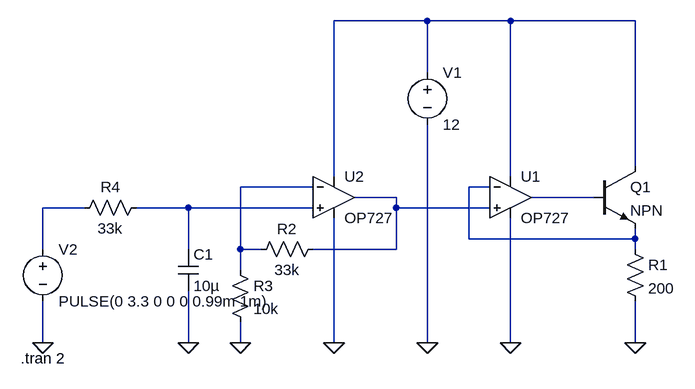
[diagram p0: schematic gauge_folower.asc]
gauge_folower.asc, the LTspice schematic file:
Version 4
SHEET 1 880 680
WIRE -48 -128 -192 -128
WIRE 80 -128 -48 -128
WIRE 272 -128 80 -128
WIRE -48 -48 -48 -128
WIRE 272 96 272 -128
WIRE -192 112 -192 -128
WIRE 80 112 80 -128
WIRE -224 128 -336 128
WIRE 48 128 16 128
WIRE -96 144 -160 144
WIRE 208 144 112 144
WIRE -576 160 -640 160
WIRE -416 160 -496 160
WIRE -224 160 -416 160
WIRE -96 160 -96 144
WIRE 48 160 -96 160
WIRE 16 208 16 128
WIRE 272 208 272 192
WIRE 272 208 16 208
WIRE -640 224 -640 160
WIRE -416 224 -416 160
WIRE -336 224 -336 128
WIRE -304 224 -336 224
WIRE -96 224 -96 160
WIRE -96 224 -224 224
WIRE 272 224 272 208
WIRE -336 256 -336 224
WIRE -640 368 -640 304
WIRE -416 368 -416 288
WIRE -336 368 -336 336
WIRE -192 368 -192 176
WIRE -48 368 -48 32
WIRE 80 368 80 176
WIRE 272 368 272 304
FLAG 272 368 0
FLAG 80 368 0
FLAG -48 368 0
FLAG -192 368 0
FLAG -336 368 0
FLAG -416 368 0
FLAG -640 368 0
SYMBOL npn 208 96 R0
SYMATTR InstName Q1
SYMBOL res 256 208 R0
SYMATTR InstName R1
SYMATTR Value 200
SYMBOL Opamps\\OP727 80 80 R0
SYMATTR InstName U1
SYMBOL Opamps\\OP727 -192 80 R0
SYMATTR InstName U2
SYMBOL voltage -48 -64 R0
WINDOW 123 0 0 Left 0
WINDOW 39 0 0 Left 0
SYMATTR InstName V1
SYMATTR Value 12
SYMBOL res -208 208 R90
WINDOW 0 0 56 VBottom 2
WINDOW 3 32 56 VTop 2
SYMATTR InstName R2
SYMATTR Value 33k
SYMBOL res -352 240 R0
SYMATTR InstName R3
SYMATTR Value 10k
SYMBOL cap -432 224 R0
SYMATTR InstName C1
SYMATTR Value 10µ
SYMBOL res -480 144 R90
WINDOW 0 0 56 VBottom 2
WINDOW 3 32 56 VTop 2
SYMATTR InstName R4
SYMATTR Value 33k
SYMBOL voltage -640 208 R0
WINDOW 123 0 0 Left 0
WINDOW 39 0 0 Left 0
SYMATTR InstName V2
SYMATTR Value PULSE(0 3.3 0 0 0 0.99m 1m)
TEXT -674 392 Left 2 !.tran 2

The netlist it stands for:
* gauge_folower.asc
Q1 N001 N005 N003 0 NPN
R1 N003 0 200
XU1 N004 N003 N001 0 N005 OP727  ; pins In+ In- V+ V- OUT
XU2 N007 N002 N001 0 N004 OP727  ; pins In+ In- V+ V- OUT
V1 N001 0 12
R2 N004 N002 33k
R3 N002 0 10k
C1 N007 0 10µ
R4 N007 N006 33k
V2 N006 0 PULSE(0 3.3 0 0 0 0.99m 1m)
.model NPN NPN
.model PNP PNP
.lib standard.bjt
.tran 2
.backanno
.end